# EasyEDA Pro project C题视觉追踪第3.1版.eprj

# Schematic Schematic1
Board Name: Board1; Create Date: 2025-04-20; Page Name: P1; Project Name: C题视觉追踪第3.1版; Schematic Name: Schematic1; Update Date: 2025-04-20; Company: 嘉立创EDA; Page Size: A4; Version: V1.0
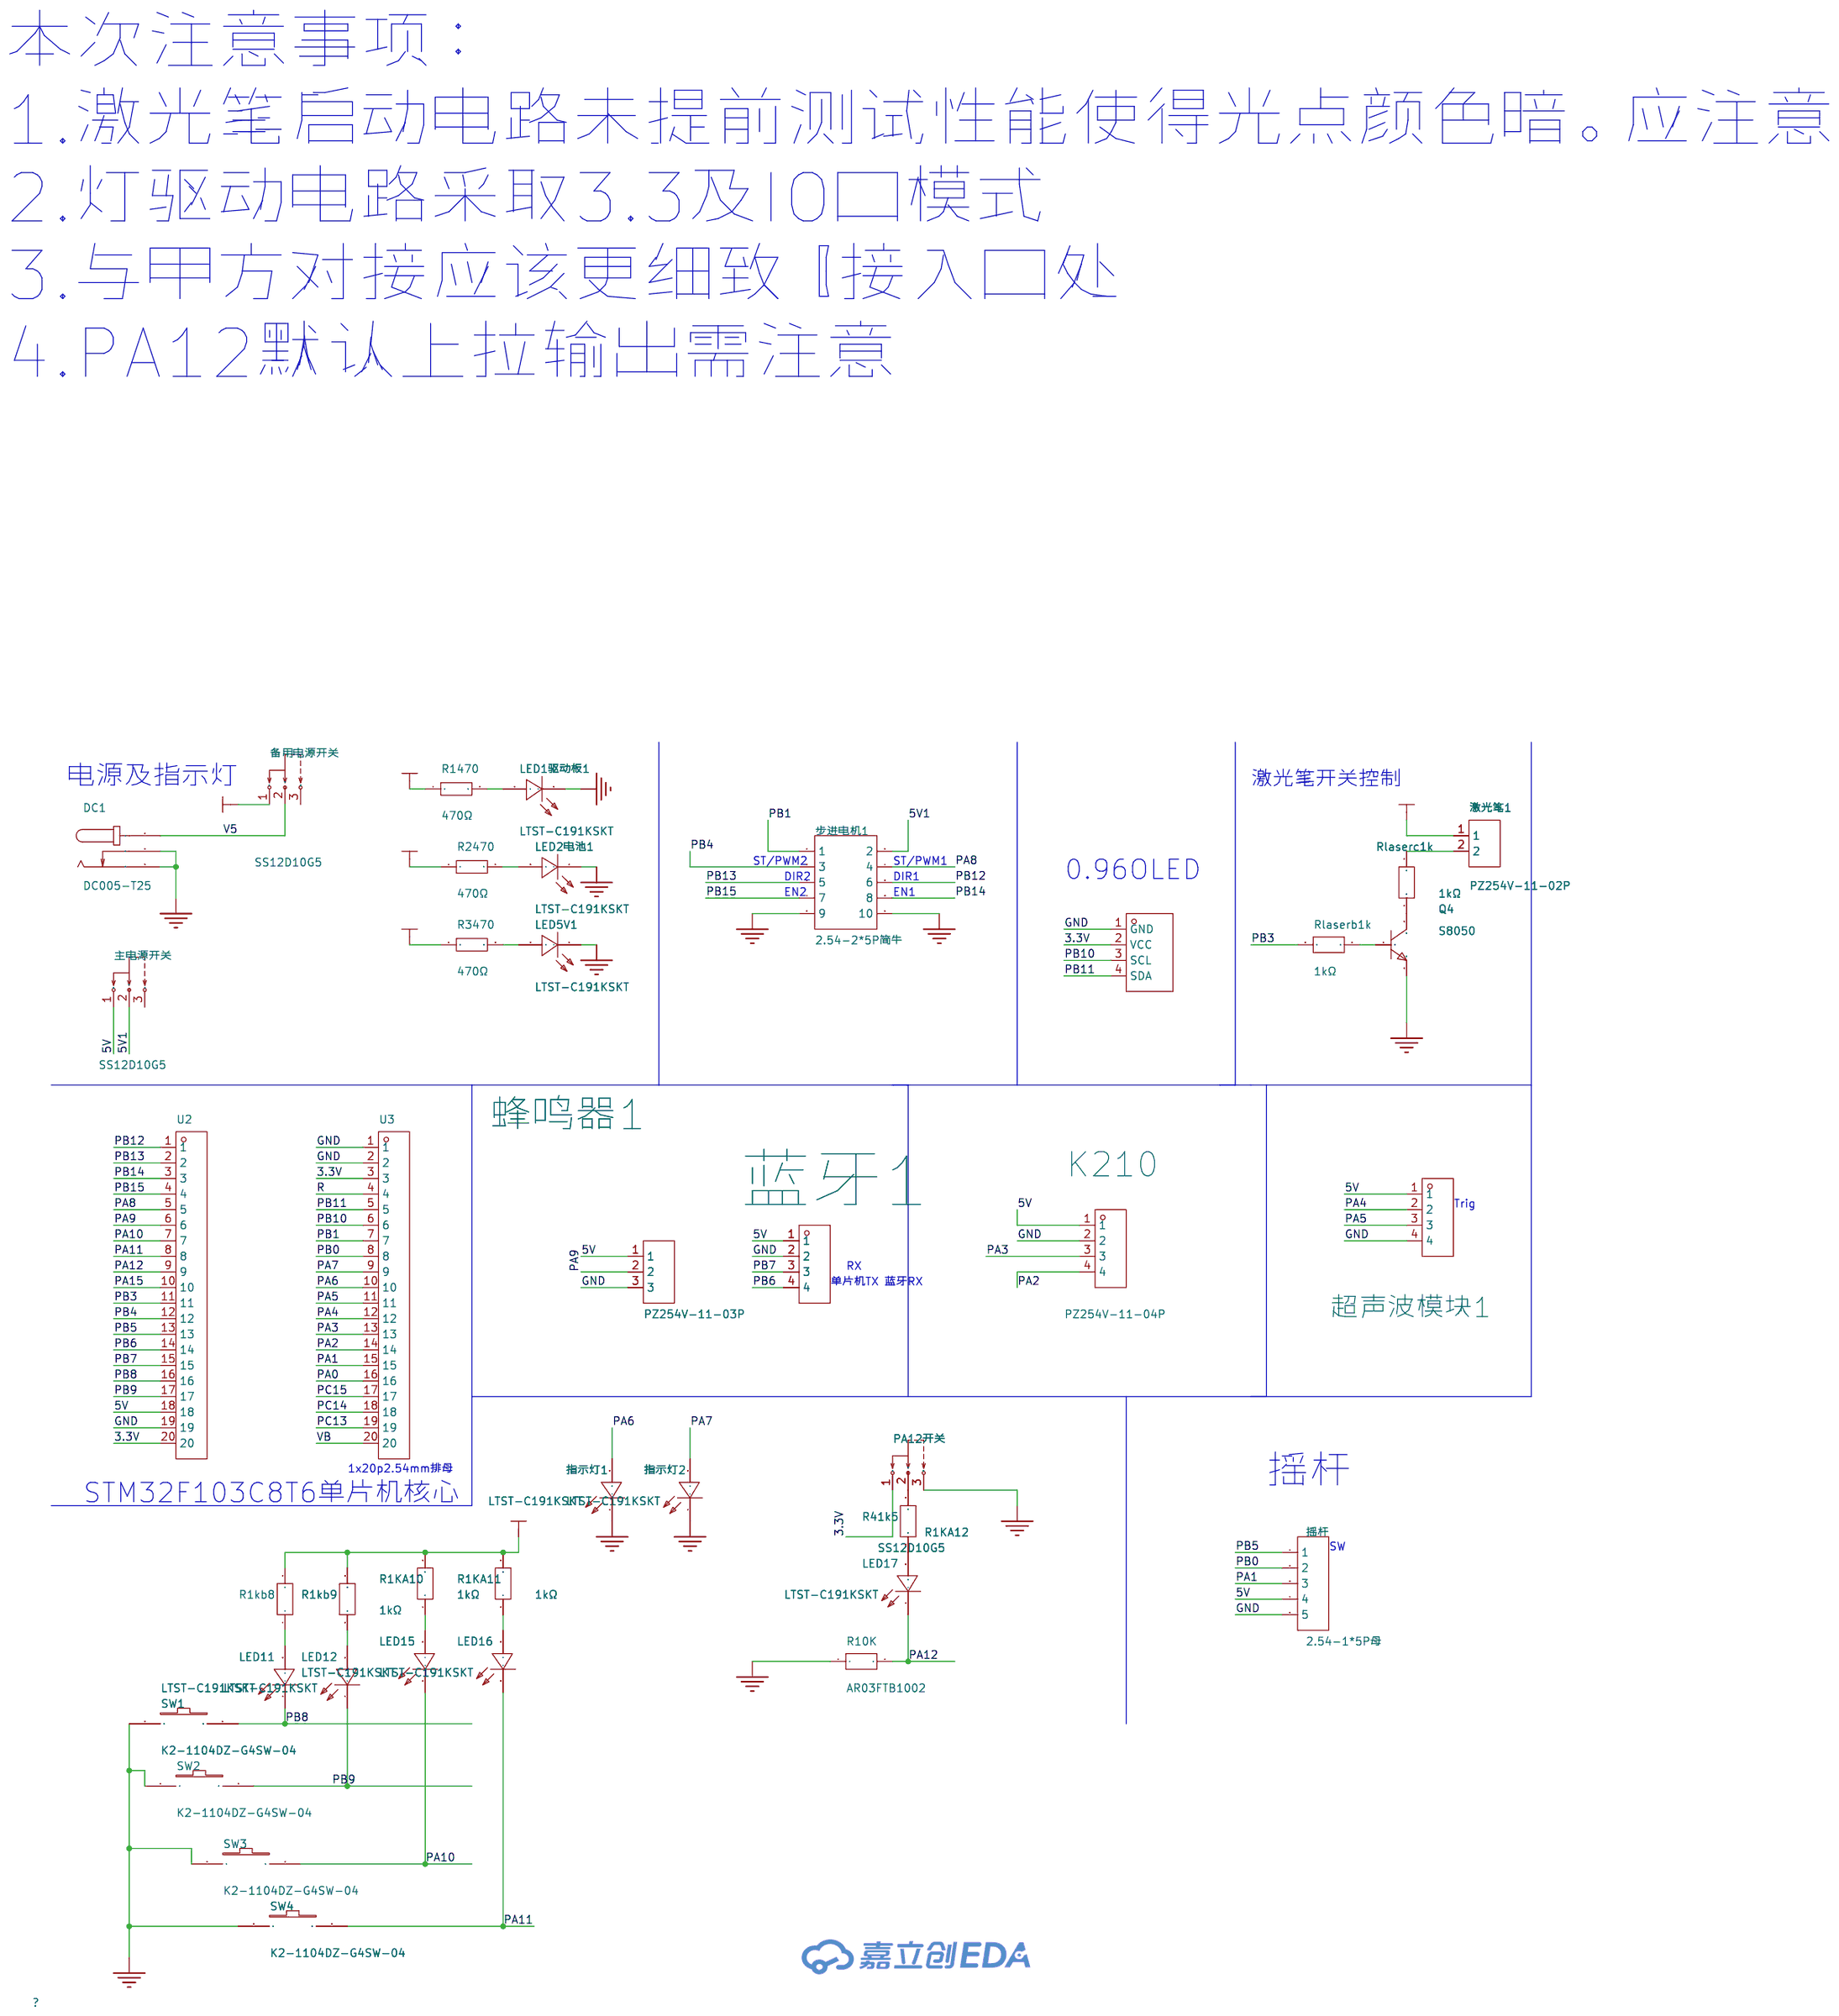
[diagram p0: schematic sheet]

## Parts
DC1  DC005-T25  [DC-IN-TH_DC-005-20A-1]
K210  PZ254V-11-04P  [HDR-TH_4P-P2.54-V-M]
LED1驱动板1  LTST-C191KSKT  [LED0603-RD-YELLOW]
LED2电池1  LTST-C191KSKT  [LED0603-RD-YELLOW]
LED5V1  LTST-C191KSKT  [LED0603-RD-YELLOW]
LED11  LTST-C191KSKT  [LED0603-RD-YELLOW]
LED12  LTST-C191KSKT  [LED0603-RD-YELLOW]
LED15  LTST-C191KSKT  [LED0603-RD-YELLOW]
LED16  LTST-C191KSKT  [LED0603-RD-YELLOW]
LED17  LTST-C191KSKT  [LED0603-RD-YELLOW]
OLED1  HS96L03W2C03  [OLED-TH_L27.8-W27.2-P2.54_C9900033791]
PA12开关  SS12D10G5  [SW-TH_SHOU-HAN_SS12D10G4]
Q4  S8050  [SOT-23-3_L2.9-W1.6-P1.90-LS2.8-BR]
R1KA10  1kΩ  [R0603]
R1KA11  1kΩ  [R0603]
R1kb8  1kΩ  [R0603]
R1kb9  1kΩ  [R0603]
R10K  AR03FTB1002  [R0603]
R41k5  1kΩ  [R0603]
R1470  470Ω  [R0603]
R2470  470Ω  [R0603]
R3470  470Ω  [R0603]
Rlaserb1k  1kΩ  [R0603]
Rlaserc1k  1kΩ  [R0603]
SW1  K2-1104DZ-G4SW-04  [KEY-TH_2P-L6.0-W6.0-P5.00]
SW2  K2-1104DZ-G4SW-04  [KEY-TH_2P-L6.0-W6.0-P5.00]
SW3  K2-1104DZ-G4SW-04  [KEY-TH_2P-L6.0-W6.0-P5.00]
SW4  K2-1104DZ-G4SW-04  [KEY-TH_2P-L6.0-W6.0-P5.00]
U2  KH-2FH-1X20P-H4.3  [hdr-th_20p-p2.54-v-f]
U3  KH-2FH-1X20P-H4.3  [hdr-th_20p-p2.54-v-f]
主电源开关  SS12D10G5  [SW-TH_SHOU-HAN_SS12D10G4]
备用电源开关  SS12D10G5  [SW-TH_SHOU-HAN_SS12D10G4]
指示灯1  LTST-C191KSKT  [LED0603-RD-YELLOW]
指示灯2  LTST-C191KSKT  [LED0603-RD-YELLOW]
摇杆  2.54-1*5P母  [HDR-TH_5P-P2.54-V-F]
步进电机1  2.54-2*5P简牛  [IDC-TH_10P-P2.54_C5665]
激光笔1  PZ254V-11-02P  [HDR-TH_2P-P2.54-V-M]
蓝牙1  2.54-1*4P母  [HDR-TH_4P-P2.54-V-F]
蜂鸣器1  PZ254V-11-03P  [HDR-TH_3P-P2.54-V-M]
超声波模块1  KH-2.54FH-1X4P-H8.5  [HDR-TH_4P-P2.54-V-F]

## Library data of the parts
DC1 = DC005-T25: 触点内径:2.5mm;触点外径:6.3mm;额定电流:-;额定电压:-;; LCSC Part Name: 内径:2.5mm 外径:6.3mm; Supplier Part: C111573; Manufacturer: SOFNG(硕方); Supplier Footprint: 插件; JLCPCB Part Class: 扩展库; Datasheet: https://atta.szlcsc.com/upload/public/pdf/source/20211217/AAF92010038535095742900872F779AE.pdf; Supplier: LCSC; Inside Contact Diameter: 2.5mm; Outside Contact Diameter: 6.3mm
K210 = PZ254V-11-04P: 插针结构:1x4P;间距:2.54mm;行距:-;圆针/方针:方针;安装类型:直插;排数:单排;总PIN位数:4P;额定电流:3A;额定电压:250V;配合针长度:6mm;塑高:2.5mm;端接针长度:3mm;触头材质:-;工作温度范围:-40℃~+105℃;颜色:黑色;; LCSC Part Name: 间距:2.54mm 1x4P 直插 方针; Supplier Part: C2691448; Manufacturer: XFCN(兴飞); Supplier Footprint: 插件,P=2.54mm; JLCPCB Part Class: 扩展库; Datasheet: https://atta.szlcsc.com/upload/public/pdf/source/20200309/C492403_F9F19131791D08044AD4F84F8E751A34.pdf; Supplier: LCSC; Pin Structure: 1x4P; Pitch: 2.54mm; Circluar Pins/Square Pins: 方针; Mounting Type: 直插; Number of Rows: 单排; Number of Pins: 4P; Current Rating (Max): 3A; Voltage Rating (Max): 250V; Length of Mating Pin: 6mm; Insulation Height: 2.5mm; Length of End Connection Pin: 3mm; Operating Temperature Range: -40℃~+105℃; Color: 黑色
LED1驱动板1 LED2电池1 LED5V1 LED11 LED12 LED15-LED17 指示灯1 指示灯2 = LTST-C191KSKT: 发光颜色:黄色;正向电压(VF):2.1V;功率:75mW;正向电流:20mA;主波长:584.5nm~597nm;二极管配置:-;透镜颜色:无色透明透镜;色温:-;发光强度:104mcd;发光角度:130°;载带方式:-;工作温度:-55℃~+85℃;; LCSC Part Name: 黄灯; Supplier Part: C125100; Manufacturer: LITEON(光宝); Supplier Footprint: 0603; JLCPCB Part Class: 扩展库; Datasheet: https://atta.szlcsc.com/upload/public/pdf/source/20180129/C125100_15171877314981315871.pdf; Supplier: LCSC; Emitted Color: 黄色; Forward Voltage (VF): 2.1V; Power Dissipation: 75mW; Forward Current: 20mA; Dominant Wavelength: 584.5nm~597nm; Peak Wavelength: 588nm; Lens Color: 无色透明透镜; Luminous Intensity: 104mcd; Viewing Angle: 130°; Operating Temperature: -55℃~+85℃
OLED1 = HS96L03W2C03: 主控芯片:SSD1315;接口类型:I2C;尺寸(inch):0.96;像素分辨率:128x64;; LCSC Part Name: 0.96寸OLED显示屏窄白光IIC; Supplier Part: C5248080; Manufacturer: HS(汉昇); JLCPCB Part Class: 扩展库; Datasheet: https://atta.szlcsc.com/upload/public/pdf/source/20230627/763D01F79A90007632F098068C7C8AD9.pdf; Supplier: LCSC; Main Control Chip: SSD1315; Interface Type: I2C; Size: 0.96; Pixel Resolution: 128x64; Operating Temperature: -40℃~+70℃
PA12开关 主电源开关 备用电源开关 = SS12D10G5: 电路结构:单刀双掷;安装方式:直插;额定电流(DC):2A;额定电压(DC):125V;机械寿命:3千次;; LCSC Part Name: 两档立式插件 3脚拨动开关 柄长5.0mm; Supplier Part: C7431054; Manufacturer: SHOU HAN(首韩); Supplier Footprint: 插件; JLCPCB Part Class: 扩展库; Datasheet: https://atta.szlcsc.com/upload/public/pdf/source/20231130/7A3DB6A149BF0A1DCFFE64FFC07FE434.pdf; Supplier: LCSC; Circuit: 单刀双掷; Switch Length: 12.7mm; Switch Width: 6.7mm; Mounting Style: 直插; Current Rating (DC): 2A; Voltage Rating (DC): 125V; Mechanical Life: 3千次; Operating Temperature: -25℃~+70℃
Q4 = S8050_C181158: 晶体管类型:NPN;集电极电流(Ic):500mA;集射极击穿电压(Vceo):25V;功率(Pd):300mW;; LCSC Part Name: NPN 电流:500mA 耐压:25V H档; Supplier Part: C181158; Manufacturer: Hottech(合科泰); Supplier Footprint: SOT-23; JLCPCB Part Class: 扩展库; Datasheet: https://atta.szlcsc.com/upload/public/pdf/source/20220506/D987F39D56F2975D34EC7947E75C4ABC.pdf; Supplier: LCSC; Transistor Type: NPN; Collector Current (Ic): 500mA; Collector-Emitter Breakdown Voltage (Vceo): 25V; Power Dissipation (Pd): 300mW; Transition Frequency (fT): 150MHz; Collector Cut-Off Current (Icbo): 100nA; Collector-Emitter Saturation Voltage (VCE(sat)@Ic,Ib): 600mV@500mA,50mA
R1KA10 R1KA11 R1kb8 R1kb9 R41k5 Rlaserb1k Rlaserc1k = FCR0603F1K: 电阻类型:厚膜电阻;阻值:1kΩ;精度:±1%;功率:100mW;最大工作电压:75V;; LCSC Part Name: 1K ±1%; Supplier Part: C5913168; Manufacturer: VO(翔胜); Supplier Footprint: 0603; JLCPCB Part Class: 扩展库; Datasheet: https://atta.szlcsc.com/upload/public/pdf/source/20230428/98B65D379E9BA4CF2A9223D1647B01B6.pdf; Supplier: LCSC; Type: 厚膜电阻; Tolerance: ±1%; Power(Watts): 100mW; Overload Voltage (Max): 75V; Operating Temperature Range: -55℃~+155℃
R10K = AR03FTB1002: LCSC Part Name: 0603 10K ±1% ±10PPM 1/16W; Supplier Part: C374599; Manufacturer: Viking(光颉); Supplier Footprint: 0603; JLCPCB Part Class: 扩展库; Datasheet: https://atta.szlcsc.com/upload/public/pdf/source/20220808/FEB8974641219B05EC1DF578AF1AC27C.pdf; Supplier: LCSC
R1470 R2470 R3470 = 0603WAF4700T5E: 电阻类型:厚膜电阻;阻值:470Ω;精度:±1%;功率:100mW;最大工作电压:75V;温度系数:±100ppm/℃;; LCSC Part Name: 470Ω ±1% 100mW 厚膜电阻; Supplier Part: C23179; Manufacturer: UNI-ROYAL(厚声); Supplier Footprint: 0603; JLCPCB Part Class: 基础库; Datasheet: https://atta.szlcsc.com/upload/public/pdf/source/20200306/C422600_1E6D84923E4A46A82E41ADD87F860B5C.pdf; Supplier: LCSC; Type: 厚膜电阻; Tolerance: ±1%; Power(Watts): 100mW; Overload Voltage (Max): 75V; Temperature Coefficient: ±100ppm/℃; Operating Temperature Range: -55℃~+155℃
SW1-SW4 = K2-1104DZ-G4SW-04: 作用力:250gf;安装方式:直插;开关长度:6mm;开关宽度:6mm;开关高度:7mm;触点电流:50mA;额定电压(DC):12V;绝缘电阻:100MΩ;机械寿命:10万次;; LCSC Part Name: 6*6*7 两脚长脚开关; Supplier Part: C961736; Manufacturer: 韩国韩荣; Supplier Footprint: 插件; JLCPCB Part Class: 扩展库; Datasheet: https://atta.szlcsc.com/upload/public/pdf/source/20201126/C961736_4F85C6E6E5B3656D5DC7C0B00D034F4A.pdf; Supplier: LCSC; Operating Force: 250gf; Mounting Style: 直插; Switch Length: 6mm; Switch Width: 6mm; Switch Height: 7mm; Contact Current: 50mA; Voltage Rating (DC): 12V; Insulation Resistance: 100MΩ; Mechanical Life: 10万次; Operating Temperature: -25℃~+85℃
U2 U3 = KH-2FH-1X20P-H4.3: 插孔结构:1x20P;间距:2mm;行距:-;圆孔/方孔:方孔;安装类型:直插;排数:单排;总孔位数:20P;额定电流:1.5A;额定电压:-;插孔方向:顶部;塑高:4.3mm;工作温度范围:-40℃~+105℃;; LCSC Part Name: 间距:2mm 1x20P 直插; Supplier Part: C2938439; Manufacturer: kinghelm(金航标); Supplier Footprint: 插件,P=2mm; JLCPCB Part Class: 扩展库; Datasheet: https://atta.szlcsc.com/upload/public/pdf/source/20211228/5EC70B7FC510D3D80A3799409C3607F1.pdf; Supplier: LCSC; Holes Structure: 1x20P; Pitch: 2mm; Circular Hole / Square Hole: 方孔; Mounting Type: 直插; Number of Rows: 单排; Number of Holes: 20P; Current Rating (Max): 1.5A; Holes Direction: 顶部; Insulation Height: 4.3mm; Operating Temperature Range: -40℃~+105℃
摇杆 = 2.54-1*5P母: 插孔结构:1x5P;间距:2.54mm;行距:-;安装类型:直插;排数:单排;总孔位数:5P;塑高:-;触头材质:-;触头镀层:-;; LCSC Part Name: 间距:2.54mm 1x5P 直插; Supplier Part: C50950; Manufacturer: BOOMELE(博穆精密); Supplier Footprint: 插件,P=2.54mm; JLCPCB Part Class: 扩展库; Datasheet: https://atta.szlcsc.com/upload/public/pdf/source/20210301/C2718488_F4427B881E42CAA8DDB0B1C12B3A522C.pdf; Supplier: LCSC; Holes Structure: 1x5P; Pitch: 2.54mm; Mounting Type: 直插; Number of Rows: 单排; Number of Holes: 5P
步进电机1 = 2.54-2*5P简牛: 连接器类型:简牛座;间距:2.54mm;结构:2x5P;封装形式:直插;行距:2.54mm;排数:2;每排PIN数:5;触头材质:-;触头镀层:-;; LCSC Part Name: 2.54mm 2x5P 排数:2 每排P数:5; Supplier Part: C5665; Manufacturer: BOOMELE(博穆精密); Supplier Footprint: 插件,P=2.54mm; JLCPCB Part Class: 扩展库; Datasheet: https://atta.szlcsc.com/upload/public/pdf/source/20140331/1457707037896.pdf; Supplier: LCSC; Connector Type: 简牛座; Pitch: 2.54mm; Structure: 2x5P; Holder Type: 直插; Row Spacing: 2.54mm; Number of Rows: 2; Pin Number in each Row: 5
激光笔1 = PZ254V-11-02P: 插针结构:1x2P;间距:2.54mm;行距:-;圆针/方针:方针;安装方式:直插;排数:单排;总PIN位数:2P;额定电流:-;额定电压:-;配合针长度:6mm;塑高:2.5mm;端接针长度:3mm;触头材质:黄铜;触头镀层:-;工作温度:-40℃~+105℃;颜色:黑色;; LCSC Part Name: 1x2P 间距:2.54mm 方针 直插; Supplier Part: C492401; Manufacturer: XFCN(兴飞); Supplier Footprint: 插件,P=2.54mm; JLCPCB Part Class: 扩展库; Datasheet: https://atta.szlcsc.com/upload/public/pdf/source/20200309/C492401_A812433581A9B211A7FFA413ADDFF0E5.pdf; Supplier: LCSC; Pin Structure: 1x2P; Pitch: 2.54mm; Circluar Pins/Square Pins: 方针; Mounting Type: 直插; Number of Rows: 单排; Number of Pins: 2P; Length of Mating Pin: 6mm; Insulation Height: 2.5mm; Length of End Connection Pin: 3mm; Contact Material: 黄铜; Operating Temperature: -40℃~+105℃; Color: 黑色
蓝牙1 = 2.54-1*4P母: 插孔结构:1x4P;间距:2.54mm;行距:-;圆孔/方孔:方孔;安装类型:直插;排数:单排;总孔位数:4P;额定电流:3A;额定电压:-;插孔方向:顶部;塑高:-;触头材质:青铜;触头镀层:-;工作温度范围:-40℃~+105℃;焊接温度(最大值):-;; LCSC Part Name: 间距:2.54mm 1x4P 直插; Supplier Part: C2718488; Manufacturer: BOOMELE(博穆精密); Supplier Footprint: 插件,P=2.54mm; JLCPCB Part Class: 扩展库; Datasheet: https://atta.szlcsc.com/upload/public/pdf/source/20210301/C2718488_F4427B881E42CAA8DDB0B1C12B3A522C.pdf; Supplier: LCSC; Holes Structure: 1x4P; Pitch: 2.54mm; Circular Hole / Square Hole: 方孔; Mounting Type: 直插; Number of Rows: 单排; Number of Holes: 4P; Current Rating (Max): 3A; Holes Direction: 顶部; Contact Material: 青铜; Operating Temperature Range: -40℃~+105℃
蜂鸣器1 = PZ254V-11-03P: 插针结构:1x3P;间距:2.54mm;行距:-;圆针/方针:方针;安装方式:直插;排数:单排;总PIN位数:3P;额定电流:3A;额定电压:250V;配合针长度:6mm;塑高:2.5mm;端接针长度:3mm;工作温度:-40℃~+105℃;颜色:黑色;; LCSC Part Name: 1x3P 间距:2.54mm 方针 直插; Supplier Part: C2937625; Manufacturer: XFCN(兴飞); Supplier Footprint: 插件,P=2.54mm; JLCPCB Part Class: 扩展库; Datasheet: https://atta.szlcsc.com/upload/public/pdf/source/20200309/C492402_8335C3D49C4E4C618838D59BB1D024C1.pdf; Supplier: LCSC; Pin Structure: 1x3P; Pitch: 2.54mm; Circluar Pins/Square Pins: 方针; Mounting Type: 直插; Number of Rows: 单排; Number of Pins: 3P; Current Rating: 3A; Voltage Rating (Max): 250V; Length of Mating Pin: 6mm; Insulation Height: 2.5mm; Length of End Connection Pin: 3mm; Operating Temperature: -40℃~+105℃; Color: 黑色
超声波模块1 = KH-2.54FH-1X4P-H8.5: 插孔结构:1x4P;间距:2.54mm;行距:-;圆孔/方孔:方孔;安装类型:直插;排数:单排;总孔位数:4P;额定电流:3A;额定电压:-;插孔方向:顶部;塑高:8.5mm;工作温度范围:-40℃~+105℃;; LCSC Part Name: 间距:2.54mm 1x4P 直插; Supplier Part: C2905415; Manufacturer: kinghelm(金航标); Supplier Footprint: 插件,P=2.54mm; JLCPCB Part Class: 扩展库; Datasheet: https://atta.szlcsc.com/upload/public/pdf/source/20211019/F01742C8B89DCA4810A857CC894DA6D1.pdf; Supplier: LCSC; Holes Structure: 1x4P; Pitch: 2.54mm; Circular Hole / Square Hole: 方孔; Mounting Type: 直插; Number of Rows: 单排; Number of Holes: 4P; Current Rating (Max): 3A; Holes Direction: 顶部; Insulation Height: 8.5mm; Operating Temperature Range: -40℃~+105℃

## Nets
3.3V: OLED1.2(VCC) PA12开关.1 R1KA10.2 R1KA11.2 R1kb8.2 R1kb9.2 U2.20 U3.3
5V: K210.1 R3470.1 U2.18 主电源开关.1 备用电源开关.1 摇杆.4 激光笔1.1 蓝牙1.1 蜂鸣器1.1 超声波模块1.1
5V1: R1470.1 主电源开关.2 步进电机1.2
GND: DC1.2 DC1.3 K210.2 LED1驱动板1.1(-) LED2电池1.1(-) LED5V1.1(-) OLED1.1(GND) PA12开关.3 Q4.2 R10K.1 SW1.1 SW2.1 SW3.1 SW4.1 U2.19 U3.1 U3.2 指示灯1.1(-) 指示灯2.1(-) 摇杆.5 步进电机1.9 步进电机1.10 蓝牙1.2 蜂鸣器1.3 超声波模块1.4
V5: DC1.1 R2470.1 备用电源开关.2
PA0: U3.16
PA1: U3.15 摇杆.3
PA2: K210.4 U3.14
PA3: K210.3 U3.13
PA4: U3.12 超声波模块1.2
PA5: U3.11 超声波模块1.3
PA6: U3.10 指示灯1.2(+)
PA7: U3.9 指示灯2.2(+)
PA8: U2.5 步进电机1.4
PA9: U2.6 蜂鸣器1.2
PA10: LED15.1(-) SW3.2 U2.7
PA11: LED16.1(-) SW4.2 U2.8
PA12: LED17.1(-) R10K.2 U2.9
PA15: U2.10
PB0: U3.8 摇杆.2
PB1: U3.7 步进电机1.1
PB3: Rlaserb1k.2 U2.11
PB4: U2.12 步进电机1.3
PB5: U2.13 摇杆.1
PB6: U2.14 蓝牙1.4
PB7: U2.15 蓝牙1.3
PB8: LED11.1(-) SW1.2 U2.16
PB9: LED12.1(-) SW2.2 U2.17
PB10: OLED1.3(SCL) U3.6
PB11: OLED1.4(SDA) U3.5
PB12: U2.1 步进电机1.6
PB13: U2.2 步进电机1.5
PB14: U2.3 步进电机1.8
PB15: U2.4 步进电机1.7
PC13: U3.19
PC14: U3.18
PC15: U3.17
R: U3.4
VB: U3.20
$1N1916: LED1驱动板1.2(+) R1470.2
$1N1920: LED5V1.2(+) R3470.2
$1N2020: Rlaserc1k.2 激光笔1.2
$1N2021: Q4.1 Rlaserb1k.1
$1N2056: LED11.2(+) R1kb8.1
$1N2059: LED12.2(+) R1kb9.1
$1N2097: LED15.2(+) R1KA10.1
$1N2098: LED16.2(+) R1KA11.1
$1N2265: PA12开关.2 R41k5.2
$1N2269: LED17.2(+) R41k5.1
$1N2620: Q4.3 Rlaserc1k.1
Net-(LED2电池1-2): LED2电池1.2(+) R2470.2

Not connected (* = marked no-connect by the designer): 主电源开关 3; 备用电源开关 3

## Notes on the sheet
- 本次注意事项：
  1.激光笔启动电路未提前测试性能使得光点颜色暗。应注意
  2.灯驱动电路采取3.3及IO口模式
  3.与甲方对接应该更细致【接入口处
  4.PA12默认上拉输出需注意
- 电源及指示灯
- 激光笔开关控制
- ST/PWM2
- DIR2
- DIR1
- ST/PWM1
- 0.96OLED
- EN2
- EN1
- Trig
- 单片机TX 蓝牙RX
- RX
- 1x20p2.54mm排母
- 摇杆
- STM32F103C8T6单片机核心
- SW

# Board PCB1
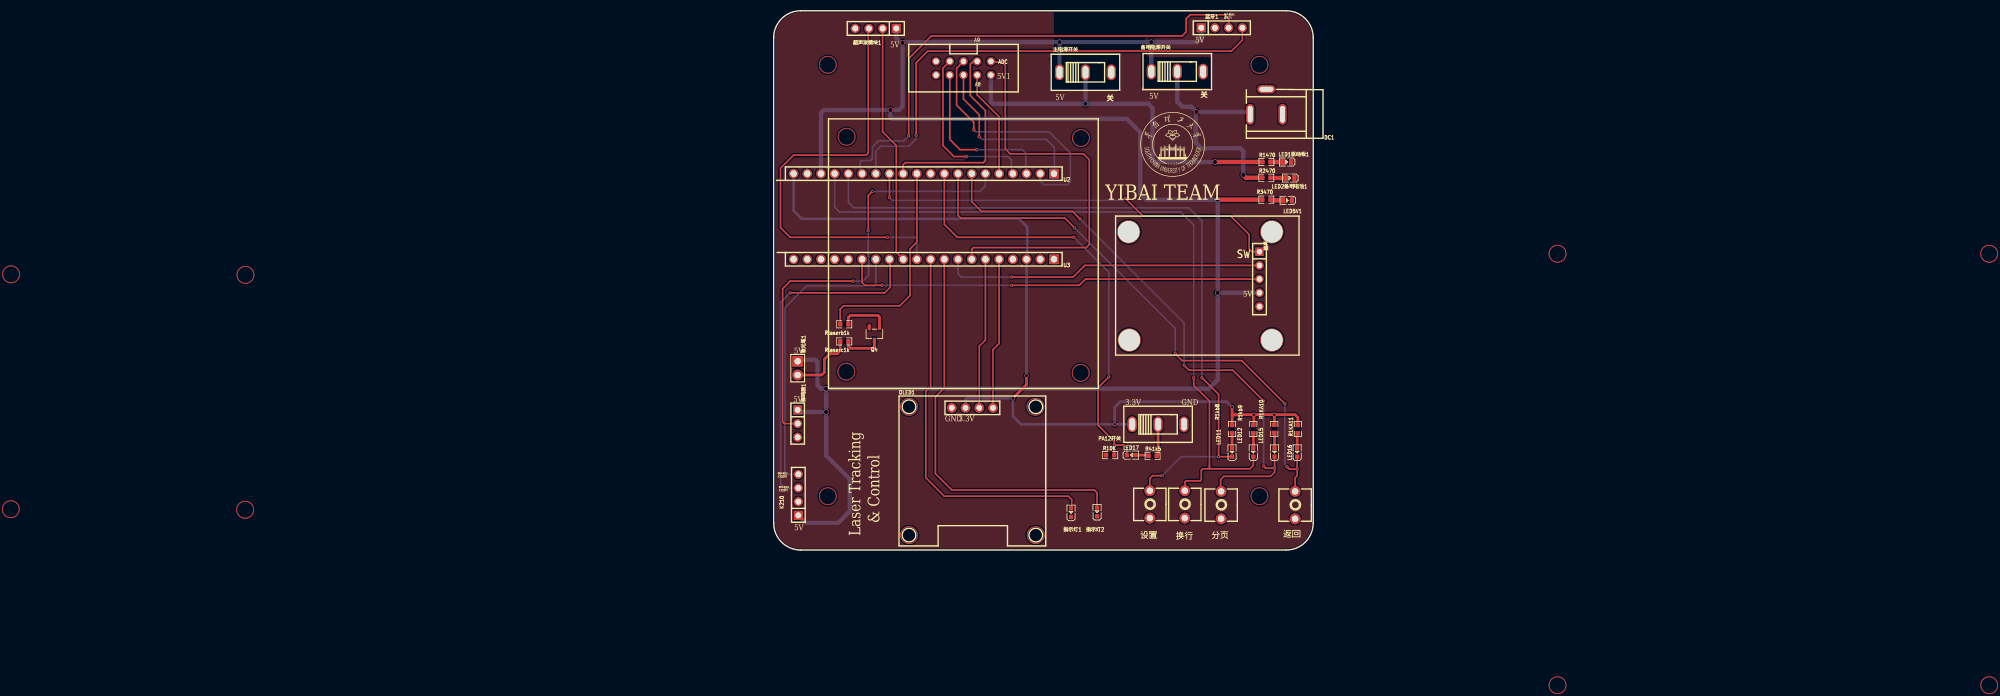
[diagram p1: board, top side]
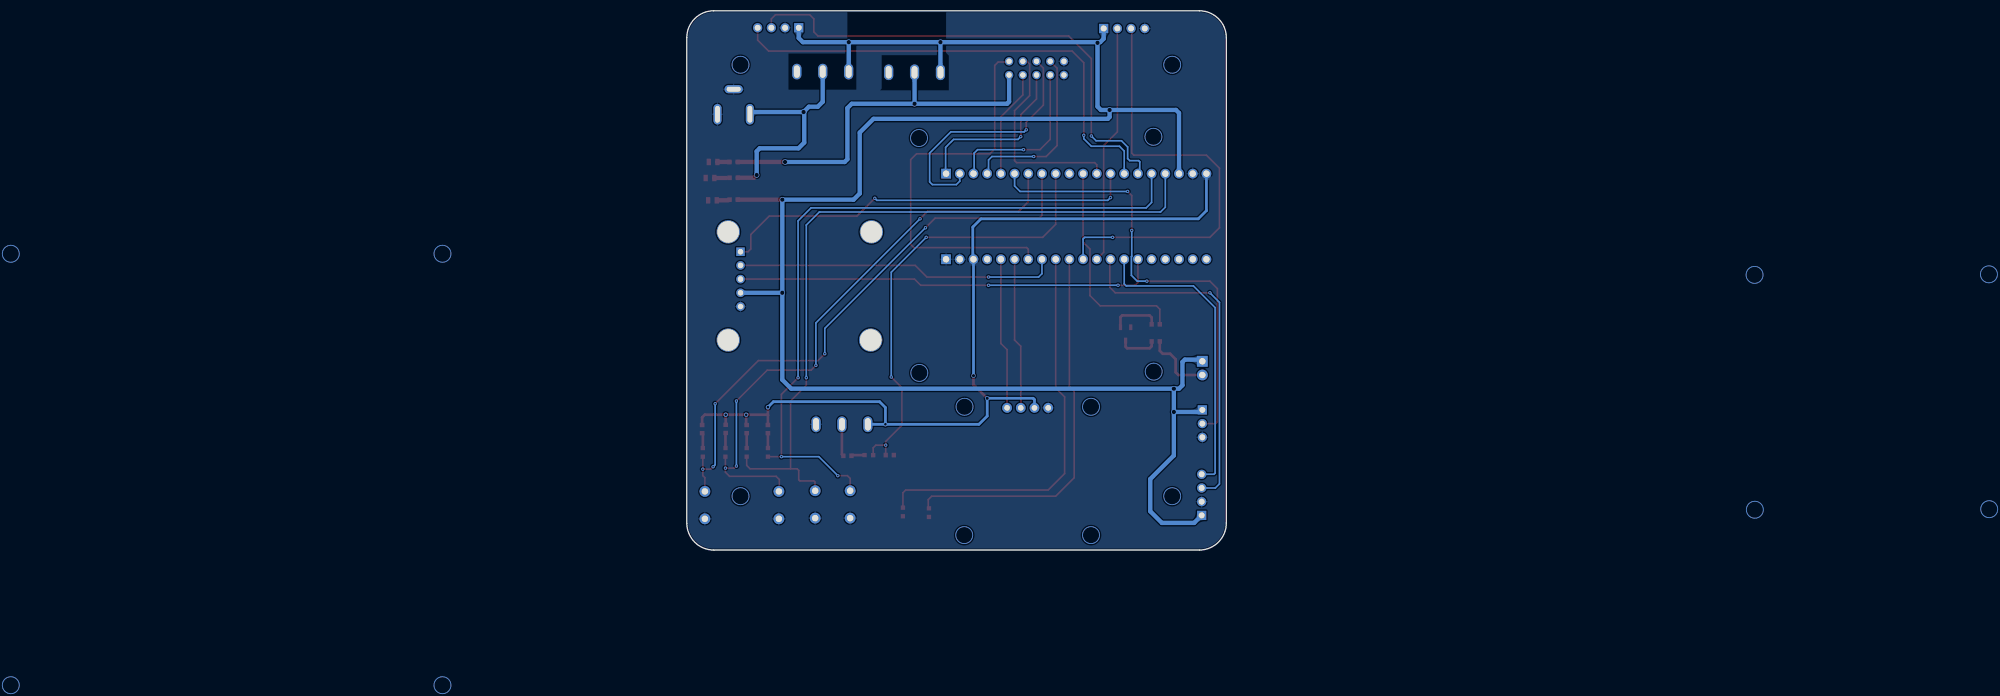
[diagram p2: board, bottom side, seen from below]

Outline 100 x 100 mm; copper layers: Top Layer, Bottom Layer. Coordinates in mm from the lower left corner of the outline.
Outline path: 0,95 0,5 arc(1.46,1.46) 5,0 95,0 arc(98.54,1.46) 100,5 100,95 arc(98.54,98.54) 95,100 5,100 arc(1.46,98.54) 0,95
Stack: Top Layer 0.035mm / Dielectric1 1.51mm FR4 er 4.5 / Bottom Layer 0.035mm

## Design rules (mm)
template: 自定义配置
spacing copperThickness1oz (default): track to track 0.102, other pairs 0.152 to 0.3
spacing copperThickness2oz: track to track 0.203, other pairs 0.152 to 0.3
track width copperThickness1oz (default): min 0.127, default 0.3, max 2.54
track width copperThickness2oz: min 0.203, default 0.254, max 2.54
differential pair differentialPair (default): width min 0.127, default 0.254, max 2.54; gap min 0.152, default 0.152
via viaSize (default): diameter min 0.5, default 0.61, max 10; hole min 0.3, default 0.305, max 6.3

## Placement (name value [footprint] x y rotation side)
DC1  DC005-T25  [DC-IN-TH_DC-005-20A-1]  91.31 83.13 180 top
K210  PZ254V-11-04P  [HDR-TH_4P-P2.54-V-M]  4.57 10.24 90 top
LED1驱动板1  LTST-C191KSKT  [LED0603-RD-YELLOW]  95.12 71.96 180 top
LED2备用电池1  LTST-C191KSKT  [LED0603-RD-YELLOW]  95.7 68.99 180 top
LED5V1  LTST-C191KSKT  [LED0603-RD-YELLOW]  95.24 64.85 180 top
LED11  LTST-C191KSKT  [LED0603-RD-YELLOW#2]  84.96 18.11 90 top
LED12  LTST-C191KSKT  [LED0603-RD-YELLOW#2]  88.9 18.11 90 top
LED15  LTST-C191KSKT  [LED0603-RD-YELLOW#2]  92.84 18.11 90 top
LED16  LTST-C191KSKT  [LED0603-RD-YELLOW#2]  97.03 18.11 90 top
LED17  LTST-C191KSKT  [LED0603-RD-YELLOW#2]  66.25 17.6 0 top
NOREF  -  [Pad_e60]  92.33 38.94 0 top
NOREF#2  -  [Pad_e66]  65.91 38.94 0 top
NOREF#3  -  [Pad_e69]  65.79 59 0 top
NOREF#4  -  [Pad_e64]  92.33 59 0 top
OLED1  HS96L03W2C03  [OLED-TH_L27.8-W27.2-P2.54_C9900033791]  36.83 26.37 0 top
PA12开关  SS12D10G5  [SW-TH_SHOU-HAN_SS12D10G4]  71.25 23.32 0 top
Q4  S8050  [SOT-23-3_L2.9-W1.6-P1.90-LS2.8-BR]  18.67 40.08 90 top
R1KA10  1kΩ  [R0603]  92.79 22.47 90 top
R1KA11  1kΩ  [R0603]  97.16 22.43 90 top
R1kb8  1kΩ  [R0603]  84.96 22.43 90 top
R1kb9  1kΩ  [R0603]  88.9 22.43 90 top
R10K  AR03FTB1002  [R0603]  62.37 17.6 0 top
R41k5  1kΩ  [R0603]  70.23 17.47 0 top
R1470  470Ω  [R0603]  91.33 71.96 0 top
R2470  470Ω  [R0603]  91.31 69.04 0 top
R3470  470Ω  [R0603]  91.31 64.97 0 top
Rlaserb1k  1kΩ  [R0603]  13.08 41.86 180 top
Rlaserc1k  1kΩ  [R0603]  13.08 38.68 180 top
U2  KH-2FH-1X20P-H4.3  [hdr-th_20p-p2.54-v-f]  27.82 69.8 180 top
U3  KH-2FH-1X20P-H4.3  [hdr-th_20p-p2.54-v-f]  27.82 53.92 180 top
主电源开关  SS12D10G5  [SW-TH_SHOU-HAN_SS12D10G4]  57.78 88.59 0 top
分页  K2-1104DZ-G4SW-04  [KEY-TH_2P-L6.0-W6.0-P5.00]  82.93 8.33 90 top
备用电源开关  SS12D10G5  [SW-TH_SHOU-HAN_SS12D10G4]  74.8 88.72 0 top
指示灯1  LTST-C191KSKT  [LED0603-RD-YELLOW#2]  55.12 6.93 90 top
指示灯2  LTST-C191KSKT  [LED0603-RD-YELLOW#2]  59.94 7.06 90 top
换行  K2-1104DZ-G4SW-04  [KEY-TH_2P-L6.0-W6.0-P5.00]  76.2 8.46 90 top
摇杆  2.54-1*5P母  [HDR-TH_5P-P2.54-V-F]  90.04 50.24 270 top
步进电机1  2.54-2*5P简牛  [IDC-TH_10P-P2.54_C5665]  35.18 89.36 180 top
激光笔1  PZ254V-11-02P  [HDR-TH_2P-P2.54-V-M]  4.44 33.73 270 top
蓝牙1  2.54-1*4P母  [HDR-TH_4P-P2.54-V-F]  83.06 96.85 0 top
蜂鸣器1  PZ254V-11-03P  [HDR-TH_3P-P2.54-V-M]  4.44 23.44 270 top
设置  K2-1104DZ-G4SW-04  [KEY-TH_2P-L6.0-W6.0-P5.00]  69.72 8.46 90 top
超声波模块1  KH-2.54FH-1X4P-H8.5  [HDR-TH_4P-P2.54-V-F]  18.92 96.72 180 top
返回  K2-1104DZ-G4SW-04  [KEY-TH_2P-L6.0-W6.0-P5.00]  96.65 8.33 90 top

## Footprints (pads in the part's own frame, mm; a bottom-side part is the same pattern mirrored in y, then rotated)
DC-IN-TH_DC-005-20A-1
  oval 1.5x3.8 hole 0.9x3.1: 1(3,2.325) 2(-3,2.325)
  oval 3.4x1.5 hole 2.6x0.9: 3(0,-2.325)
HDR-TH_2P-P2.54-V-M
  rect 2x2 hole 1.2: 1(-1.27,0)
  round 2 hole 1.2: 2(1.27,0)
HDR-TH_3P-P2.54-V-M
  rect 1.7x1.7 hole 1.1: 1(-2.54,0)
  round 1.7 hole 1.1: 2(0,0) 3(2.54,0)
HDR-TH_4P-P2.54-V-F
  rect 1.7x1.7 hole 1.1: 1(-3.81,0)
  round 1.7 hole 1.1: 2(-1.27,0) 3(1.27,0) 4(3.81,0)
HDR-TH_4P-P2.54-V-M
  rect 1.7x1.7 hole 1.1: 1(-3.81,0)
  round 1.7 hole 1.1: 2(-1.27,0) 3(1.27,0) 4(3.81,0)
HDR-TH_5P-P2.54-V-F
  rect 1.575x1.575 hole 1.02: 1(-5.08,0)
  round 1.575 hole 1.02: 2(-2.54,0) 3(0,0) 4(2.54,0) 5(5.08,0)
hdr-th_20p-p2.54-v-f
  rect 1.8x1.8 hole 1.2: 1(-24.13,0)
  round 1.8 hole 1.2: 2(-21.59,0) 3(-19.05,0) 4(-16.51,0) 5(-13.97,0) 6(-11.43,0) 7(-8.89,0) 8(-6.35,0) 9(-3.81,0) 10(-1.27,0) 11(1.27,0) 12(3.81,0) 13(6.35,0) 14(8.89,0) 15(11.43,0) 16(13.97,0) 17(16.51,0) 18(19.05,0) 19(21.59,0) 20(24.13,0)
IDC-TH_10P-P2.54_C5665
  round 1.524 hole 1: 1(-5.08,-1.27) 2(-5.08,1.27) 3(-2.54,-1.27) 4(-2.54,1.27) 5(0,-1.27) 6(0,1.27) 7(2.54,-1.27) 8(2.54,1.27) 9(5.08,-1.27) 10(5.08,1.27)
KEY-TH_2P-L6.0-W6.0-P5.00
  round 2 hole 1.2: 1(-2.54,0) 2(2.54,0)
LED0603-RD-YELLOW
  rect 0.8x1.2 smd: 1(-0.799,-0.004) 2(0.799,0.004)
LED0603-RD-YELLOW#2
  rect 0.8x0.8 smd: 1(-0.799,-0.004) 2(0.799,0.004)
OLED-TH_L27.8-W27.2-P2.54_C9900033791
  round 1.8 hole 1.05: 1(-3.81,0) 2(-1.27,0) 3(1.27,0) 4(3.81,0)
Pad_e60
  round 4.3 hole 4: 1(0,0)
Pad_e64
  round 4.3 hole 4: 1(0,0)
Pad_e66
  round 4.3 hole 4: 1(0,0)
Pad_e69
  round 4.3 hole 4: 1(0,0)
R0603
  rect 0.806x0.864 smd: 1(-0.753,0) 2(0.753,0)
SOT-23-3_L2.9-W1.6-P1.90-LS2.8-BR
  rect 1.07x0.6 smd: 1(1.235,-0.95) 2(1.235,0.95) 3(-1.235,0)
SW-TH_SHOU-HAN_SS12D10G4
  oval 1.7x2.9 hole 1.1x2.3: 1(-4.8,0) 2(0,0) 3(4.8,0)

## Nets
As in the schematic, except:
GND: DC1.2 DC1.3 K210.2 LED1驱动板1.1 LED2备用电池1.1 LED5V1.1 OLED1.1 PA12开关.3 Q4.2 R10K.1 U2.19 U3.1 U3.2 分页.1 指示灯1.1 指示灯2.1 换行.1 摇杆.5 步进电机1.9 步进电机1.10 蓝牙1.2 蜂鸣器1.3 设置.1 超声波模块1.4 返回.1
PA10: LED15.1 U2.7 分页.2
PA11: LED16.1 U2.8 返回.2
PB8: LED11.1 U2.16 设置.2
PB9: LED12.1 U2.17 换行.2
$1N1915: LED2备用电池1.2 R2470.2

Pads without a net: NOREF 1; NOREF#2 1; NOREF#3 1; NOREF#4 1; 主电源开关 3; 备用电源开关 3

## Via types
v1: diameter 3.3, hole 3, Top Layer to Bottom Layer, 20 vias
v2: diameter 0.61, hole 0.305, Top Layer to Bottom Layer, 33 vias
v3: diameter 1, hole 0.8, Top Layer to Bottom Layer, 12 vias
v4: diameter 0.8, hole 0.6, Top Layer to Bottom Layer, 2 vias
v5: diameter 0.8, hole 0.5, Top Layer to Bottom Layer, 4 vias

## Routing (per net, layer and track width the routed paths; a pad name or vN(x,y) marks a point on that pad's centre or on a via; arc(x,y) is an arc through that point)
3.3V: length 167.5
  Top Layer w0.5: v5(92.79,25.09) 96.66,25.09 97.16,24.59 R1KA11.2 ; v5(92.79,25.09) R1KA10.2 ; v5(92.79,25.09) v5(89,25.09) ; 84.96,24.99 R1kb8.2 ; 84.96,24.99 v5(84.96,26.49) ; 84.96,24.99 85.07,25.09 v5(89,25.09) ; v5(89,25.09) 89,23.28 R1kb9.2 ; v4(46.86,32.33) 46.86,30.68 v4(44.32,28.14)
  Bottom Layer w0.5: OLED1.2 35.56,27.89 35.81,28.14 v4(44.32,28.14) 44.32,24.84 45.85,23.32 v5(63.19,23.32) ; v5(63.19,23.32) PA12开关.1 ; v5(63.19,23.32) 63.19,26.43 64.26,27.51 83.95,27.51 v5(84.96,26.49) ; U2.20 3.69,62.94 5.21,61.42 45.47,61.42 46.99,59.89 46.99,54.05 U3.3 46.87,32.34 v4(46.86,32.33)
5V: length 359.5
  Top Layer w0.8: v3(82.3,64.97) R3470.1
  Bottom Layer w0.8: v3(23.88,94.06) 24,94.18 v3(52.99,94.18) ; v3(23.88,94.06) 23.75,94.18 23.37,94.18 22.73,94.82 超声波模块1.1 ; v3(23.88,94.06) 23.88,82.25 23.24,81.61 v3(21.63,81.61) ; v3(9.72,25.6) 4.83,25.6 蜂鸣器1.1 ; v3(9.72,25.6) v3(9.72,29.92) ; v3(9.72,25.6) 9.72,17.53 14.1,13.16 14.1,7.19 11.94,5.03 5.97,5.03 K210.1 ; v3(69.98,94.18) 69.98,88.75 备用电源开关.1 ; v3(69.98,94.18) v3(52.99,94.18) ; v3(69.98,94.18) 78.49,94.18 79.25,94.94 蓝牙1.1 ; v3(52.99,94.18) 主电源开关.1 ; v3(21.63,81.61) 21.63,80.3 21.97,79.96 65.41,79.96 67.94,77.42 67.94,66.12 69.09,64.97 v3(82.3,64.97) v3(82.3,47.7) ; v3(21.63,81.61) 9.33,81.61 8.77,81.04 U2.18 ; 摇杆.4 v3(82.3,47.7) ; v3(82.3,47.7) 82.3,31.57 80.65,29.92 v3(9.72,29.92) ; 激光笔1.1 4.75,35.31 7.69,35.31 8.13,34.87 8.13,30.56 8.76,29.92 v3(9.72,29.92)
5V1: length 71.3
  Top Layer w0.8: R1470.1 81.79,71.96 v3(81.79,71.96)
  Bottom Layer w0.8: v3(57.78,82.75) 40.64,82.75 40.26,83.13 步进电机1.2 ; v3(57.78,82.75) 69.43,82.75 70.23,81.95 70.23,72.47 70.74,71.96 v3(81.79,71.96) ; v3(57.78,82.75) 主电源开关.2
V5: length 43.6
  Top Layer w0.8: R2470.1 87.56,69.04 v3(87.05,69.55)
  Bottom Layer w0.8: 78.23,81.35 77.38,82.21 75.73,82.21 74.8,83.13 备用电源开关.2 ; 78.23,81.35 v3(78.36,81.22) ; 78.23,81.35 78.23,81.22 ; DC1.1 87.9,81.22 v3(78.36,81.22) ; v3(87.05,69.55) 87.05,73.93 86.49,74.5 79.29,74.5 78.23,75.55 78.23,81.22 ; v3(78.36,81.22) 78.23,81.22
(no net):
  vias: v1(-141.35,51.13) v1(-141.4,7.57) v1(-97.96,7.47) v1(-97.91,51.03) v1(10.03,89.99) v1(10.03,9.98) v1(13.51,76.63) v1(13.46,33.08) v1(25.08,26.56) v1(25.08,2.76) v1(48.52,26.56) v1(48.58,2.76) v1(56.9,32.85) v1(56.96,76.4) v1(90.04,89.99) v1(90.04,9.98) v1(145.29,54.94) v1(145.29,-25.07) v1(225.3,54.94) v1(225.3,-25.07)
PA1: length 78.7
  Top Layer w0.3: v2(20.07,49.1) 16.89,49.1 16.39,49.6 U3.15 ; v2(44.07,49.1) 56.64,49.1 57.78,50.24 摇杆.3
  Bottom Layer w0.3: v2(44.07,49.1) v2(20.07,49.1)
PA2: length 56.5
  Bottom Layer w0.3: K210.4 2.29,14.05 2.07,14.26 2.07,44.95 6.1,48.97 18.54,48.97 18.93,49.36 18.93,53.92
PA3: length 64
  Top Layer w0.3: U3.13 21.59,53.8 21.59,48.72 20.57,47.7 v2(3.05,47.7)
  Bottom Layer w0.3: K210.3 2.03,11.51 1.27,12.27 1.27,45.92 v2(3.05,47.7)
PA4: length 44.4
  Top Layer w0.3: 超声波模块1.2 20.19,77.55 22.73,75.01 22.73,55.2 24.01,53.92
PA5: length 81.5
  Top Layer w0.3: 超声波模块1.3 17.53,96.6 17.53,73.61 17.14,73.23 3.68,73.23 1.27,70.81 1.27,59.77 3.05,57.99 v2(21.08,57.99)
  Bottom Layer w0.3: U3.11 26.55,57.69 26.25,57.99 v2(21.08,57.99)
PA6: length 71.3
  Top Layer w0.3: 指示灯1.2 55.25,7.86 55.25,9.35 54.61,9.98 31.62,9.98 28.19,13.41 28.19,29.41 29.09,30.31 U3.10
PA7: length 74.6
  Top Layer w0.3: 31.63,53.92 31.63,30.05 29.97,28.4 29.97,14.17 33.02,11.12 59.44,11.12 59.94,10.62 指示灯2.2
PA8: length 20
  Top Layer w0.3: 步进电机1.4 37.72,84.4 41.79,80.34 U2.5
PA9: length 84.2
  Top Layer w0.3: v2(14.73,49.86) 3.05,49.86 1.65,48.46 1.65,23.74 1.95,23.44 蜂鸣器1.2 ; v2(18.29,66.5) 17.53,65.73 v2(17.53,59.26)
  Bottom Layer w0.3: v2(18.29,66.5) 38.23,66.5 39.25,67.52 U2.6 ; v2(14.73,49.86) 16.51,49.86 17.59,50.94 17.59,54.42 17.53,54.48 v2(17.53,59.26)
PA10: length 109.2
  Top Layer w0.3: v2(56.77,61.42) 55.37,62.81 38.48,62.81 36.71,64.59 U2.7 ; v2(90.81,27.63) 85.09,33.35 76.96,33.35 v2(76.07,34.24) ; 82.93,10.87 82.85,10.96 82.85,13.07 83.44,13.66 92.07,13.66 92.84,14.43 v2(92.84,15.19) ; v2(92.84,15.19) 91.19,15.19 v2(90.81,15.57) ; v2(92.84,15.19) LED15.1
  Bottom Layer w0.3: v2(76.07,34.24) 76.07,42.11 v2(56.77,61.42) ; v2(90.81,27.63) v2(90.81,15.57)
PA11: length 106.1
  Top Layer w0.3: v2(94.74,27.13) 86.74,35.13 75.69,35.13 v2(74.42,36.4) ; v2(55.75,59.77) 53.97,61.54 34.67,61.54 34.17,62.05 U2.8 ; v2(97.03,14.99) 95.57,14.99 v2(95.12,15.44) ; v2(97.03,14.99) LED16.1 ; v2(97.03,14.99) 97.03,14.99 97.03,13.79 96.65,13.41 96.65,10.87
  Bottom Layer w0.3: v2(74.42,36.4) 74.42,41.1 v2(55.75,59.77) ; v2(94.74,27.13) 94.74,15.82 v2(95.12,15.44)
PA12: length 83.4
  Top Layer w0.3: v2(62.1,32.08) 60.13,30.11 60.13,23.13 63.13,20.13 v2(63.13,19.45) ; LED17.1 65.45,18.95 64.96,19.45 v2(63.13,19.45) ; v2(63.13,19.45) R10K.2 ; 31.63,69.8 31.63,60.4 34.04,57.99 v2(55.63,57.99)
  Bottom Layer w0.3: v2(55.63,57.99) 62.1,51.51 v2(62.1,32.08)
PB0: length 59.7
  Top Layer w0.3: 摇杆.2 57.66,52.78 55.5,50.62 v2(44.07,50.62)
  Bottom Layer w0.3: U3.8 34.17,51.25 34.8,50.62 v2(44.07,50.62)
PB1: length 74.6
  Top Layer w0.3: U3.7 36.71,55.78 37.01,56.08 57.91,56.08 58.5,56.68 58.5,72.38 57.4,73.48 43.81,73.48 42.93,74.37 42.93,89.86 42.29,90.5 40.39,90.5 步进电机1.1
PB3: length 39.9
  Top Layer w0.3: U2.11 26.55,57.1 25.27,55.83 25.27,47.19 23.37,45.29 12.95,45.29 12.33,44.66 Rlaserb1k.2
PB4: length 37.8
  Top Layer w0.3: 步进电机1.3 36.96,90.63 36.45,90.12 36.45,84.28 39.25,81.48 39.25,72.21 38.87,71.83 24.38,71.83 24,71.45 24,69.8 24.01,69.8
PB5: length 79.1
  Top Layer w0.3: 摇杆.1 88.65,55.32 88.14,55.83 88.14,58.5 84.71,61.92 68.45,61.92 v2(65.15,65.23) ; U2.13 v2(21.47,65.35)
  Bottom Layer w0.3: v2(65.15,65.23) 64.77,64.85 21.97,64.85 v2(21.47,65.35)
PB6: length 91.2
  Top Layer w0.3: 蓝牙1.4 86.87,94.56 84.84,92.53 28.57,92.53 26.42,90.37 v2(26.42,76.91)
  Bottom Layer w0.3: v2(26.42,76.91) 26.42,76.28 25.02,74.88 19.81,74.88 18.93,73.99 18.93,69.8
PB7: length 95
  Top Layer w0.3: v2(25.02,76.78) 25.02,91.14 29.21,95.33 75.69,95.33 76.45,96.09 76.45,98.5 77.22,99.26 83.57,99.26 84.33,98.5 蓝牙1.3
  Bottom Layer w0.3: v2(25.02,76.78) 24.13,75.89 19.43,75.89 18.29,74.75 18.29,72.59 17.91,72.21 16.26,72.21 16.04,72 16.04,70.14 U2.15
PB8: length 136.5
  Top Layer w0.3: v2(72.01,13.79) 70.23,13.79 69.72,13.28 设置.2 ; v2(79.38,31.95) 82.46,28.87 v2(82.46,17.31) LED11.1
  Bottom Layer w0.3: v2(72.01,13.79) 75.53,17.31 v2(82.46,17.31) ; U2.16 13.85,64.46 14.86,63.45 76.96,63.45 79.38,61.04 v2(79.38,31.95)
PB9: length 138.8
  Top Layer w0.3: 80.77,15.06 80.77,27.63 77.85,30.56 v2(77.85,31.95) ; 80.77,15.06 88.26,15.06 88.9,15.7 LED12.1 ; 80.77,15.06 79.55,15.06 79.25,14.76 79.25,13.03 79.04,12.82 76.45,12.82 76.24,12.61 76.24,11.04 换行.2
  Bottom Layer w0.3: 11.31,69.8 11.31,63.57 12.19,62.69 75.44,62.69 77.85,60.27 v2(77.85,31.95)
PB10: length 28
  Top Layer w0.3: OLED1.3 38.1,37.8 39.25,38.94 U3.6
PB11: length 28
  Top Layer w0.3: OLED1.4 40.64,37.16 41.79,38.31 U3.5
PB12: length 32.3
  Top Layer w0.3: 步进电机1.6 35.18,83.64 38.1,80.72 v2(38.1,76.66)
  Bottom Layer w0.3: v2(38.1,76.66) 38.61,76.15 50.55,76.15 52.03,74.67 52.03,69.88 U2.1
PB13: length 47
  Top Layer w0.3: v2(37.08,77.93) 37.08,79.32 33.91,82.5 33.91,89.36 步进电机1.5
  Bottom Layer w0.3: 49.41,69.8 49.41,68.4 50.04,67.77 54.48,67.77 54.99,68.28 54.99,73.61 51.05,77.55 37.47,77.55 v2(37.08,77.93)
PB14: length 31
  Top Layer w0.3: v2(37.59,74.24) 34.54,74.24 32.64,76.15 步进电机1.8
  Bottom Layer w0.3: v2(37.59,74.24) 46.1,74.24 46.74,73.61 46.74,69.93 U2.3
PB15: length 32.6
  Top Layer w0.3: 步进电机1.7 31.37,89.36 31.37,75.01 33.4,72.97 v2(35.69,72.97)
  Bottom Layer w0.3: v2(35.69,72.97) 43.43,72.97 44.07,72.34 44.07,70.06 U2.4
$1N1915: length 2.3
  Top Layer w0.8: 92.64,68.99 94.9,68.99 LED2备用电池1.2
$1N1916: length 2.2
  Top Layer w0.8: R1470.2 94.31,71.96 LED1驱动板1.2
$1N1920: length 2.1
  Top Layer w0.3: LED5V1.2 94.44,64.85 94.07,64.85
  Top Layer w0.8: 92.31,64.85 94.07,64.85
$1N2020: length 12.9
  Top Layer w0.5: 激光笔1.2 8.89,32.46 9.4,32.97 9.4,35.38 10.41,36.4 11.78,36.4 12.33,36.95 Rlaserc1k.2
$1N2021: length 9.2
  Top Layer w0.5: Rlaserb1k.1 13.83,43.12 14.22,43.51 19.3,43.51 19.62,43.19 Q4.1
$1N2056: length 2.8
  Top Layer w0.5: R1kb8.1 84.96,18.91 LED11.2
$1N2059: length 2.8
  Top Layer w0.5: R1kb9.1 88.9,18.91 LED12.2
$1N2097: length 2.8
  Top Layer w0.5: LED15.2 92.83,21.67 R1KA10.1
$1N2098: length 2.8
  Top Layer w0.5: LED16.2 97.02,21.54 R1KA11.1
$1N2265: length 6
  Top Layer w0.5: R41k5.2 71.25,17.74 PA12开关.2
$1N2269: length 2.5
  Top Layer w0.5: LED17.2 69.35,17.6 R41k5.1
$1N2620: length 7.1
  Top Layer w0.5: Q4.3 18.67,37.7 18.38,37.41 14.22,37.41 13.83,37.8 Rlaserc1k.1

## Copper pours and planes (outline as drawn; the poured copper is in the pictures)
GND on Top Layer: -4.7,101.55 -8.13,104.98 46.23,104.98 49.91,101.3 51.69,101.3 51.94,101.55 51.94,92.02 50.93,91.01 51.31,90.63 51.31,85.12 63.55,85.12 63.88,84.78 64.26,85.17 64.26,91.77 53.34,91.77 53.21,91.64 53.21,100.53 52.83,100.91 53.21,101.3 68.07,101.3 68.07,85.95 68.33,85.7 80.77,85.7 81.22,85.25 81.22,91.06 80.9,91.39 69.47,91.39 68.92,91.94 68.92,101.25 69.34,101.68 105.41,101.68 105.92,101.17 105.92,-5.13 105.66,-5.38 -1.14,-5.38 -4.7,-1.83
GND on Bottom Layer: -3.81,102.69 48.9,102.69 51.94,99.64 51.94,92.2 51.44,91.69 51.44,85.25 64.18,85.25 63.88,85.55 63.88,91.77 53.59,91.77 53.59,101.04 53.34,101.3 68.07,101.3 68.58,101.8 68.58,85.37 81.15,85.37 81.15,92.07 70.79,92.07 70.74,92.02 70.23,92.53 70.23,101.42 104.14,101.42 104.39,101.68 105.66,100.41 105.66,-4.24 0.89,-4.24 -3.81,0.46

Small or netless copper shapes (teardrops, artwork), in the pictures only: 128 on Top Layer, 99 on Bottom Layer

## Text on the board
Top Silkscreen Layer: A9 | A8 | ADC | SW | Laser Tracking / & Control | YIBAI TEAM | 单片机TX / K210RX | 单片机RX / K210TX | 单片机RX / 蓝牙TX | 5V | GND | 3.3V | 5V1 | 关

# Board PCB2
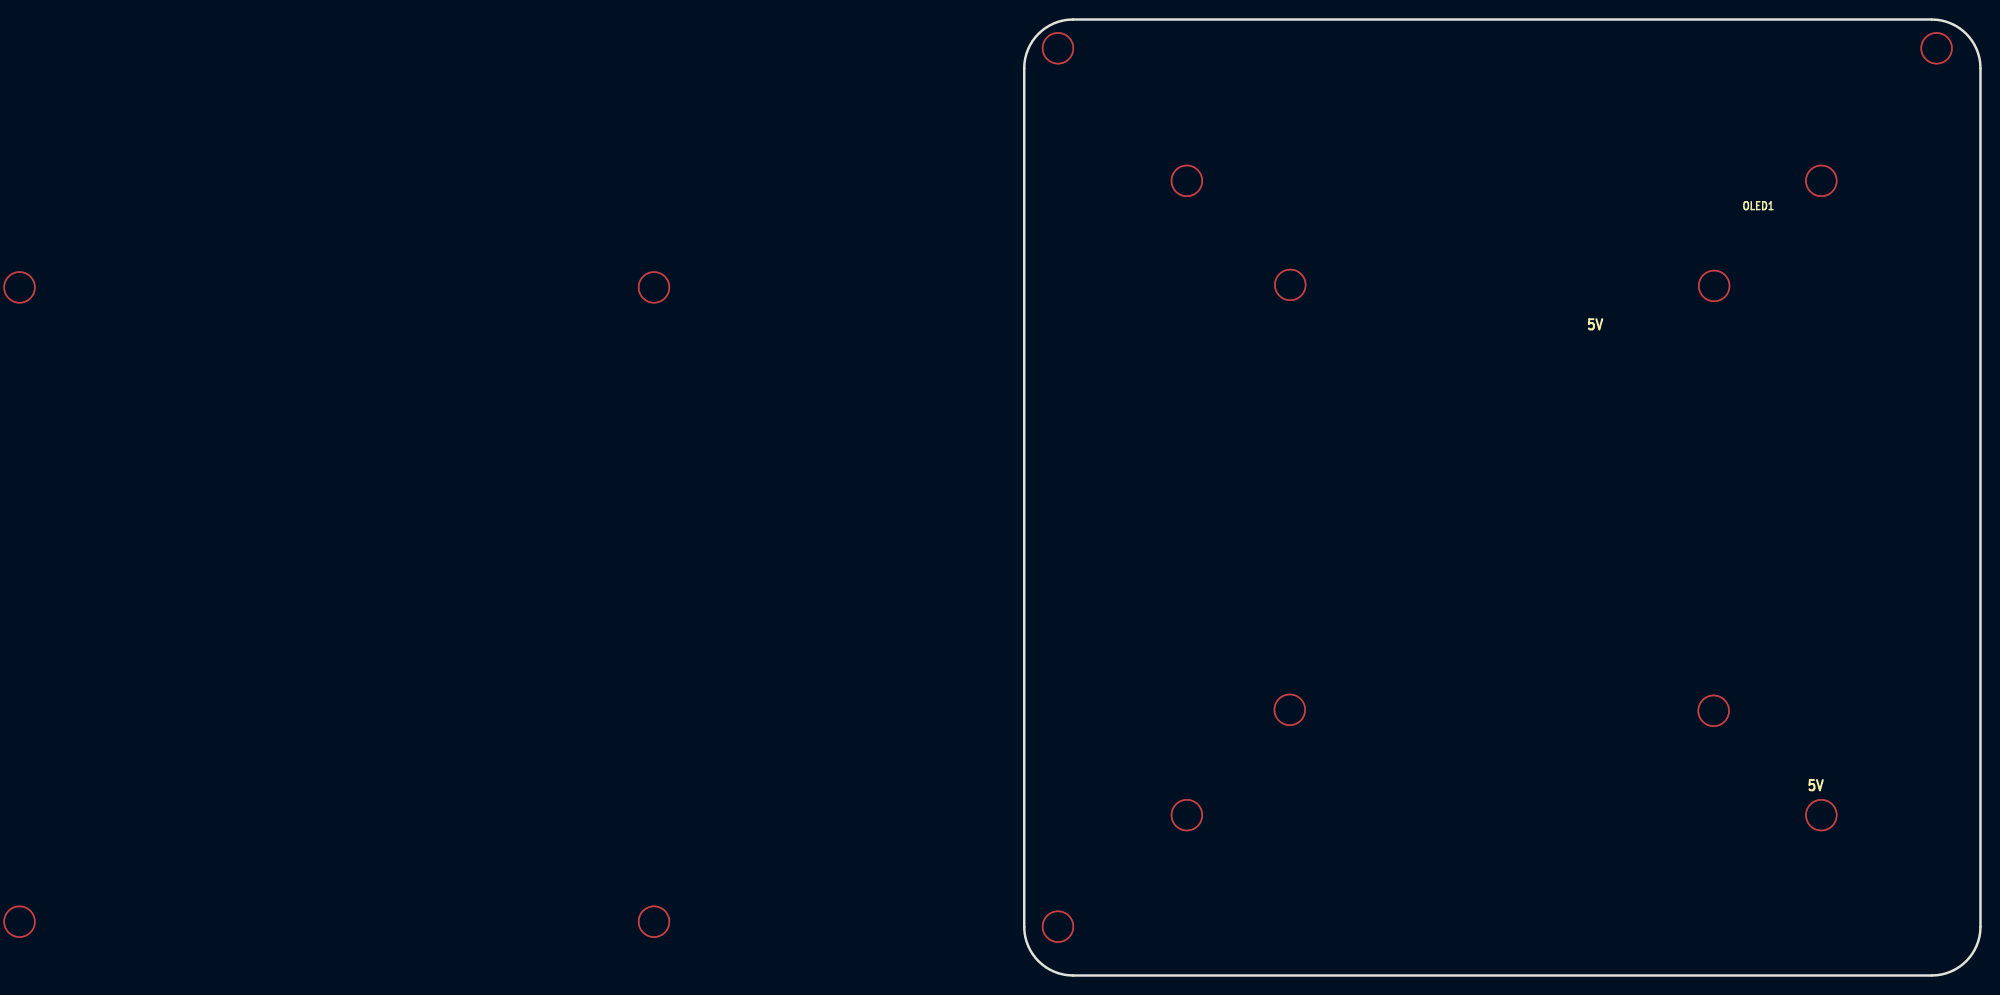
[diagram p3: board, top side]
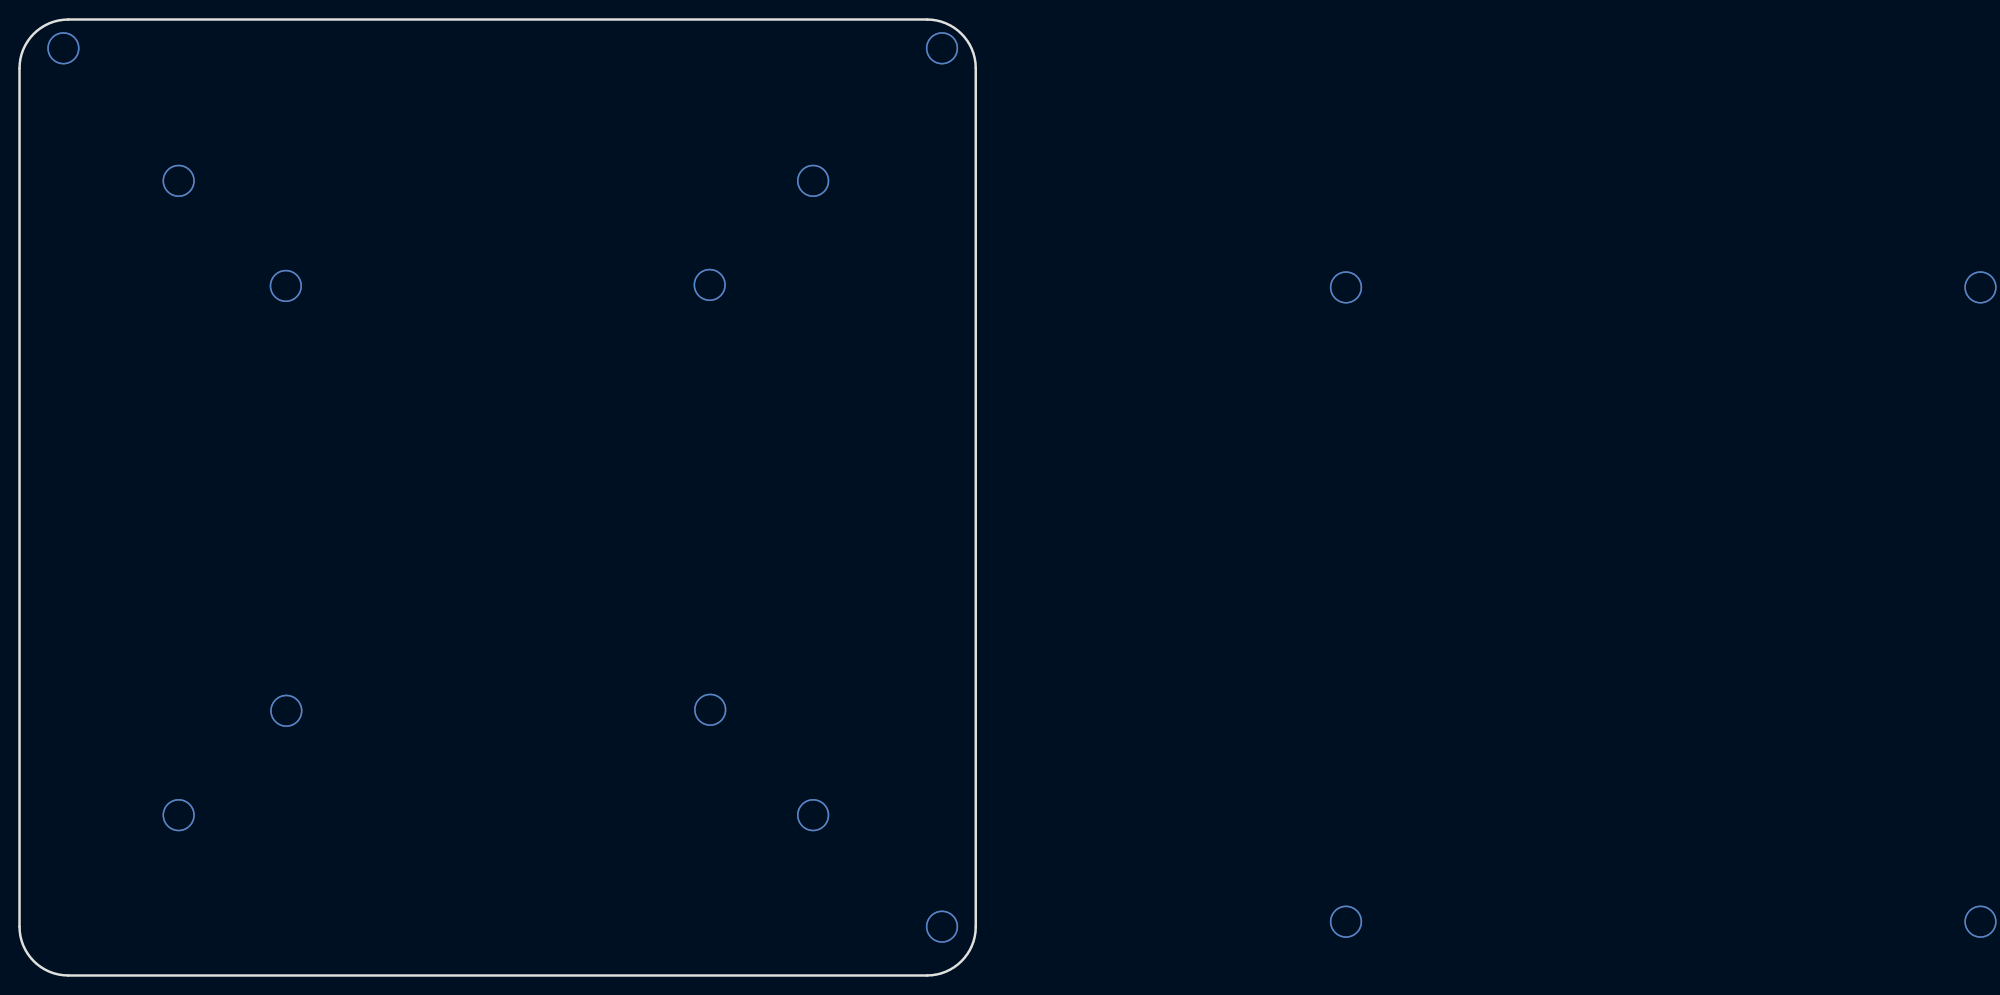
[diagram p4: board, bottom side, seen from below]

Outline 98 x 98 mm; copper layers: Top Layer, Bottom Layer. Coordinates in mm from the lower left corner of the outline.
Outline path: 0,93 0,5 arc(1.46,1.46) 5,0 93,0 arc(96.54,1.46) 98,5 98,93 arc(96.54,96.54) 93,98 5,98 arc(1.46,96.54) 0,93
Stack: Top Layer 0.035mm / Dielectric1 1.51mm FR4 er 4.5 / Bottom Layer 0.035mm

## Design rules (mm)
template: JLCPCB Capability(Two Layers Board)
spacing copperThickness1oz (default): track to track 0.102, other pairs 0.152 to 0.3
spacing copperThickness2oz: track to track 0.203, other pairs 0.152 to 0.3
track width copperThickness1oz (default): min 0.127, default 0.254, max 2.54
track width copperThickness2oz: min 0.203, default 0.254, max 2.54
differential pair differentialPair (default): width min 0.127, default 0.254, max 2.54; gap min 0.152, default 0.152
via viaSize (default): diameter min 0.5, default 0.61, max 10; hole min 0.3, default 0.305, max 6.3

## Placement (name value [footprint] x y rotation side)

## Nets

## Via types
v1: diameter 3.3, hole 3, Top Layer to Bottom Layer, 15 vias

## Routing (per net, layer and track width the routed paths; a pad name or vN(x,y) marks a point on that pad's centre or on a via; arc(x,y) is an arc through that point)
(no net):
  vias: v1(-102.97,70.54) v1(-102.97,5.51) v1(-37.94,70.54) v1(-37.94,5.51) v1(3.46,95.05) v1(3.46,5.01) v1(16.67,81.46) v1(16.67,16.44) v1(27.27,70.79) v1(27.21,27.24) v1(70.65,27.13) v1(70.71,70.69) v1(81.69,81.46) v1(81.69,16.44) v1(93.5,95.05)

## Copper pours and planes (outline as drawn; the poured copper is in the pictures)
GND on Top Layer: 127.79,81.59 202.98,81.59 205.13,79.43 205.13,7.42 205.26,7.29 194.21,7.29 193.58,7.93 193.58,14.28 187.1,20.75 183.42,20.75 183.42,26.64 182.66,27.41 170.29,27.41 169.45,28.25 169.45,22.17 169.96,21.66 166,21.66 165.26,22.41 165.26,27.48 152.56,27.48 152.43,27.36 152.43,20.67 152.56,20.54 166.1,20.54 166.78,19.87 187.23,19.87 192.18,14.91 192.18,14.66 192.82,14.02 192.82,7.67 131.73,7.67 127.79,11.61
GND on Bottom Layer: -133.45,99.88 -131.03,97.46 -52.55,97.46 -52.55,31.68 -62.45,21.77 -65.76,21.77 -68.68,24.69 -68.68,31.8 -75.28,38.41 -78.96,38.41 -79.09,38.53 -79.09,44.88 -92.3,44.88 -92.55,45.14 -92.68,45.01 -92.68,38.53 -96.59,38.53 -97.12,39.07 -97.12,44.88 -97,45.01 -109.95,45.01 -110.08,45.14 -110.21,45.01 -110.21,38.66 -98.26,38.66 -97.83,38.23 -77.14,38.23 -70.71,31.8 -69.82,31.8 -69.82,26.22 -69.44,25.83 -131.42,25.83 -133.07,24.18 -133.07,83.11 -132.3,83.87 -133.45,85.02

## Text on the board
Top Silkscreen Layer: OLED1 | 5V
